# Altium schematic sheet top.SchDoc
size A4; SheetNumber: 2
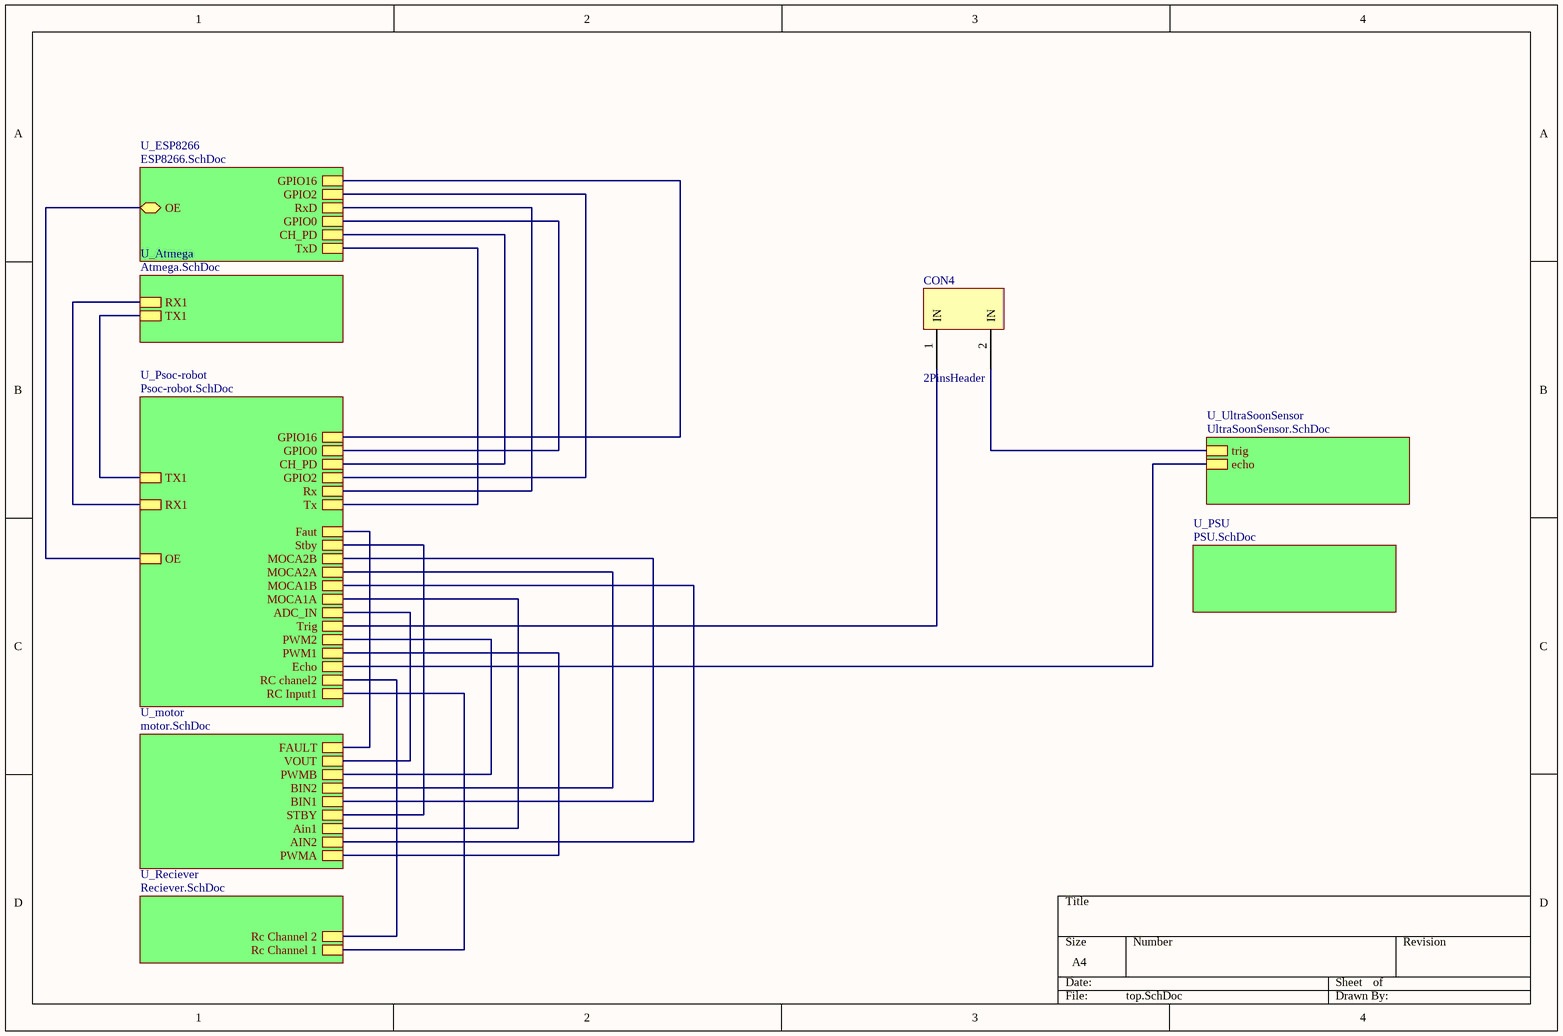
[diagram p0: top.SchDoc]

## Parts
CON4  2PinsHeader  [2PinsHeader]

## Sub-sheets
U_Atmega = Atmega.SchDoc: RX1, TX1
U_ESP8266 = ESP8266.SchDoc: TxD, CH_PD, GPIO0, RxD, GPIO2, GPIO16, OE
U_motor = motor.SchDoc: PWMA, AIN2, Ain1, STBY, BIN1, BIN2, PWMB, VOUT, FAULT
U_Psoc-robot = Psoc-robot.SchDoc: RC Input1, RC chanel2, Echo, PWM1, PWM2, Trig, ADC_IN, MOCA1A, MOCA1B, MOCA2A, MOCA2B, Stby, Faut, Tx, Rx, GPIO2, CH_PD, GPIO0, GPIO16, OE, RX1, TX1
U_PSU = PSU.SchDoc: no entries
U_Reciever = Reciever.SchDoc: Rc Channel 1, Rc Channel 2
U_UltraSoonSensor = UltraSoonSensor.SchDoc: trig, echo

## Nets
NetCON4_1: CON4.1(IN) ; sheet U_Psoc-robot/Trig
NetCON4_2: CON4.2(IN) ; sheet U_UltraSoonSensor/trig
(unnamed): sheet U_ESP8266/TxD, sheet U_Psoc-robot/Tx
(unnamed): sheet U_ESP8266/CH_PD, sheet U_Psoc-robot/CH_PD
(unnamed): sheet U_ESP8266/GPIO0, sheet U_Psoc-robot/GPIO0
(unnamed): sheet U_ESP8266/RxD, sheet U_Psoc-robot/Rx
(unnamed): sheet U_ESP8266/GPIO2, sheet U_Psoc-robot/GPIO2
(unnamed): sheet U_ESP8266/GPIO16, sheet U_Psoc-robot/GPIO16
(unnamed): sheet U_ESP8266/OE, sheet U_Psoc-robot/OE
(unnamed): sheet U_UltraSoonSensor/echo, sheet U_Psoc-robot/Echo
(unnamed): sheet U_motor/PWMA, sheet U_Psoc-robot/PWM1
(unnamed): sheet U_motor/AIN2, sheet U_Psoc-robot/MOCA1B
(unnamed): sheet U_motor/Ain1, sheet U_Psoc-robot/MOCA1A
(unnamed): sheet U_motor/STBY, sheet U_Psoc-robot/Stby
(unnamed): sheet U_motor/BIN1, sheet U_Psoc-robot/MOCA2B
(unnamed): sheet U_motor/BIN2, sheet U_Psoc-robot/MOCA2A
(unnamed): sheet U_motor/PWMB, sheet U_Psoc-robot/PWM2
(unnamed): sheet U_motor/VOUT, sheet U_Psoc-robot/ADC_IN
(unnamed): sheet U_motor/FAULT, sheet U_Psoc-robot/Faut
(unnamed): sheet U_Reciever/Rc Channel 1, sheet U_Psoc-robot/RC Input1
(unnamed): sheet U_Reciever/Rc Channel 2, sheet U_Psoc-robot/RC chanel2
(unnamed): sheet U_Atmega/RX1, sheet U_Psoc-robot/RX1
(unnamed): sheet U_Atmega/TX1, sheet U_Psoc-robot/TX1